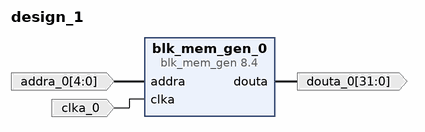
[diagram p0: block diagram of the top level]
# Vivado block design design_1, xc7z010clg400-1, Vivado 2023.1
create_bd_design design_1

create_bd_port -dir I -from 4 -to 0 addra_0
create_bd_port -dir I -type clk clka_0
create_bd_port -dir O -from 31 -to 0 douta_0

create_bd_cell -type ip -vlnv xilinx.com:ip:blk_mem_gen:8.4 blk_mem_gen_0
set_property -dict [list \
  CONFIG.Coe_File ../design_1_blk_mem_gen_0_0.coe \
  CONFIG.Enable_A Always_Enabled \
  CONFIG.Fill_Remaining_Memory_Locations true \
  CONFIG.Load_Init_File true \
  CONFIG.Memory_Type Single_Port_ROM \
  CONFIG.Remaining_Memory_Locations 1 \
  CONFIG.Write_Depth_A 32 \
  CONFIG.use_bram_block Stand_Alone \
] [get_bd_cells blk_mem_gen_0]

# ---- connections ----

connect_bd_net -net addra_0_1 [get_bd_ports addra_0] [get_bd_pins blk_mem_gen_0/addra]
connect_bd_net [get_bd_pins blk_mem_gen_0/douta] [get_bd_ports douta_0]
connect_bd_net -net clka_0_1 [get_bd_ports clka_0] [get_bd_pins blk_mem_gen_0/clka]

validate_bd_design
save_bd_design
